# EAGLE design Tasmodul_GPS (EAGLE 9.6.2)
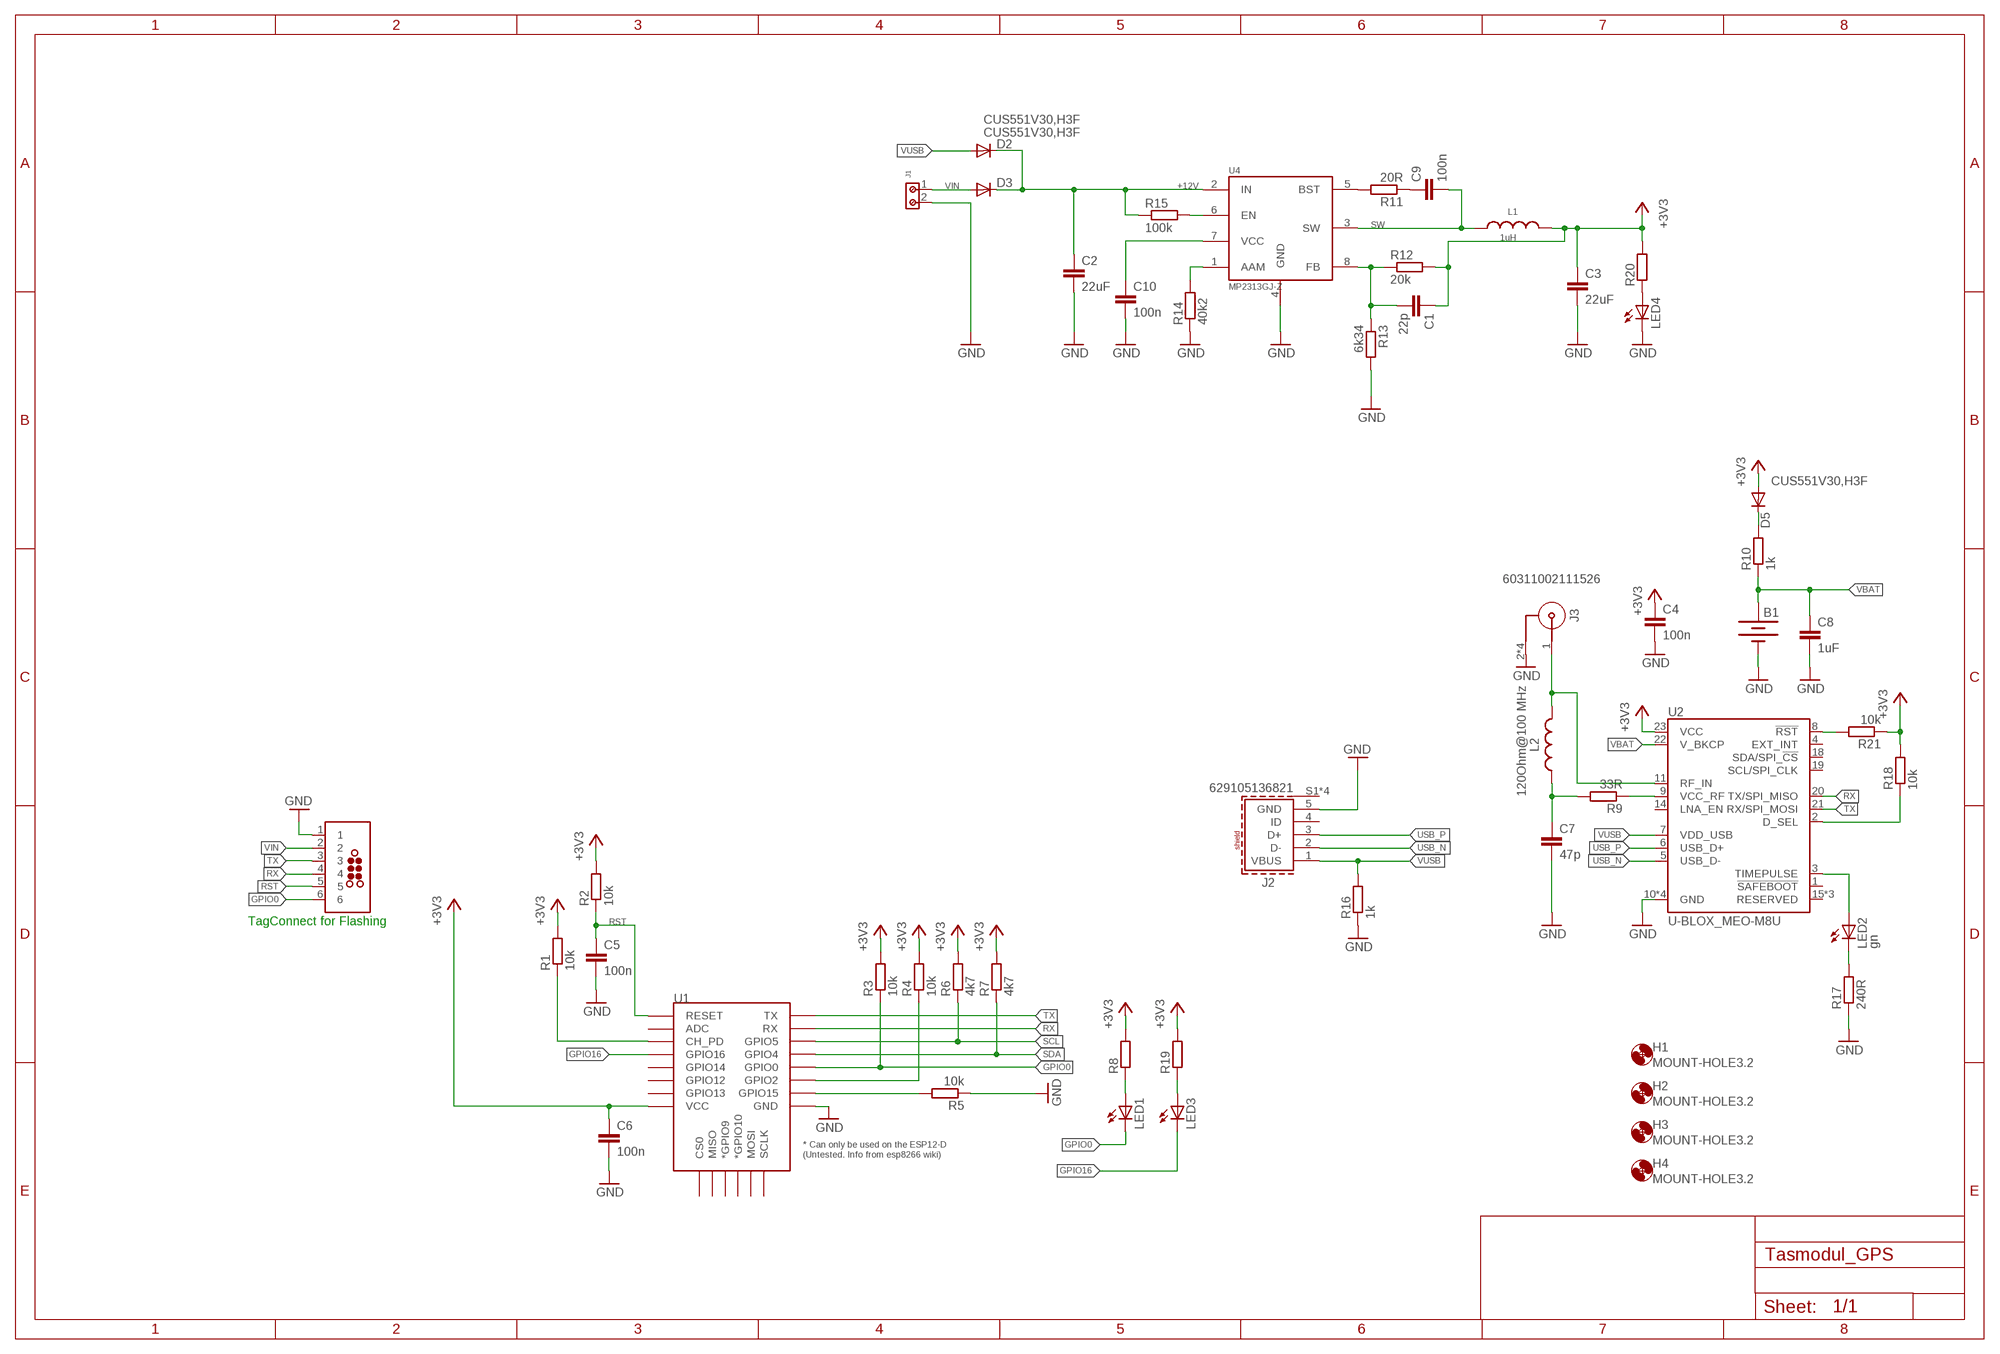
[diagram p0: schematic, sheet 1]

## Parts
B1  6.8MM_COIN_CELL  ML414H_IV01E_BATTERY  [ML414H_IV01E]
C1  22p  C-EUC0603  [C0603]
C2  22uF  C-EUC0805  [C0805]
C3  22uF  C-EUC0805  [C0805]
C4  100n  C-EUC0603  [C0603]
C5  100n  C-EUC0603  [C0603]
C6  100n  C-EUC0603  [C0603]
C7  47p  C-EUC0603  [C0603]
C8  1uF  C-EUC0603  [C0603]
C9  100n  C-EUC0603  [C0603]
C10  100n  C-EUC0603  [C0603]
D2  CUS551V30,H3F  DIODE-SOD323-R  [SOD323-R]
D3  CUS551V30,H3F  DIODE-SOD323-R  [SOD323-R]
D5  CUS551V30,H3F  DIODE-SOD323-R  [SOD323-R]
H1  MOUNT-HOLE3.2  [3,2]
H2  MOUNT-HOLE3.2  [3,2]
H3  MOUNT-HOLE3.2  [3,2]
H4  MOUNT-HOLE3.2  [3,2]
J1  691210910002  [691210910002]
J2  629105136821  [629105136821]
J3  60311002111526  [60311002111526]
J6  TC2030-MCP-NL  [TC2030-MCP-NL]
L1  1uH  WE-TPC_2811_744028001  [WE-TPC_2811_OLD]
L2  120Ohm@100 MHz  WE-CBF_0603_74279262_WB_HS  [WE-CBF_0603(W=2.2)]
LED1  LEDCHIP-LED0603  [CHIP-LED0603]
LED2  gn  LEDCHIP-LED0603  [CHIP-LED0603]
LED3  LEDCHIP-LED0603  [CHIP-LED0603]
LED4  LEDCHIP-LED0603  [CHIP-LED0603]
R1  10k  R-EU_R0603  [R0603]
R2  10k  R-EU_R0603  [R0603]
R3  10k  R-EU_R0603  [R0603]
R4  10k  R-EU_R0603  [R0603]
R5  10k  R-EU_R0603  [R0603]
R6  4k7  R-EU_R0603  [R0603]
R7  4k7  R-EU_R0603  [R0603]
R8  R-EU_R0603  [R0603]
R9  33R  R-EU_R0603  [R0603]
R10  1k  R-EU_R0603  [R0603]
R11  20R  R-EU_R0603  [R0603]
R12  20k  R-EU_R0603  [R0603]
R13  6k34  R-EU_R0603  [R0603]
R14  40k2  R-EU_R0603  [R0603]
R15  100k  R-EU_R0603  [R0603]
R16  1k  R-EU_R0603  [R0603]
R17  240R  R-EU_R0603  [R0603]
R18  10k  R-EU_R0603  [R0603]
R19  R-EU_R0603  [R0603]
R20  R-EU_R0603  [R0603]
R21  10k  R-EU_R0603  [R0603]
U1  ESP12ESMD  [ESP12E-SMD]
U2  U-BLOX_MEO-M8U  [NEO-M9N/M8T/M8U]
U4  MP2313GJ-Z  [TSOT23-8_MPS]

## Nets
+3V3: C1.1 C3.1 C4.1 C6.1 D5.A L1.2 R1.2 R2.2 R3.2 R4.2 R6.2 R7.2 R8.2 R12.2 R18.2 R19.2 R20.2 R21.1 U1.VCC U2.23(VCC)
+12V: C2.1 D2.C D3.C R15.1 U4.2(IN)
GND: B1.- C2.2 C3.2 C4.2 C5.2 C6.2 C7.2 C8.2 C10.2 J1.2 J2.5(GND) J3.2 J3.3 J3.4 J3.5 J6.1 LED4.C R5.1 R13.2 R14.1 R16.1 R17.1 U1.GND U2.10(GND) U2.12(GND) U2.13(GND) U2.24(GND) U4.4(GND)
GPIO0: J6.6 LED1.C R3.1 U1.GPIO0
GPIO16: LED3.C U1.GPIO16
N$1: LED1.A R8.1
N$2: LED2.C R17.2
N$3: J3.1 L2.2 U2.11(RF_IN)
N$4: R21.2 U2.8(!RST)
N$5: R1.1 U1.CH_PD
N$6: R5.2 U1.GPIO15
N$7: R4.1 U1.GPIO2
N$8: D5.C R10.2
N$9: R11.2 U4.5(BST)
N$10: C9.1 R11.1
N$11: R9.1 U2.9(VCC_RF)
N$12: C1.2 R12.1 R13.1 U4.8(FB)
N$13: C10.1 U4.7(VCC)
N$14: R14.2 U4.1(AAM)
N$15: R15.2 U4.6(EN)
N$16: C7.1 L2.1 R9.2
N$17: LED2.A U2.3(TIMEPULSE)
N$18: R18.1 U2.2(D_SEL)
N$19: LED3.A R19.1
N$20: LED4.A R20.1
RST: C5.1 J6.5 R2.1 U1.RESET
RX: J6.4 U1.RXD0(RX) U2.20(TX/SPI_MISO)
SCL: R6.1 U1.GPIO5
SDA: R7.1 U1.GPIO4
SW: C9.2 L1.1 U4.3(SW)
TX: J6.3 U1.TXD0(TX) U2.21(RX/SPI_MOSI)
USB_N: J2.2(D-) U2.5(USB_D-)
USB_P: J2.3(D+) U2.6(USB_D+)
VBAT: B1.+ C8.1 R10.1 U2.22(V_BKCP)
VIN: D3.A J1.1 J6.2
VUSB: D2.A J2.1(VBUS) R16.2 U2.7(VDD_USB)
Unconnected: J2.4(ID) J2.S1(SHIELD) J2.S2(SHIELD) J2.S3(SHIELD) J2.S4(SHIELD) U1.ADC U1.CS0 U1.GPIO9(*GPIO9) U1.GPIO10(*GPIO10) U1.GPIO12 U1.GPIO13 U1.GPIO14 U1.MISO U1.MOSI U1.SCLK U2.1(!SAFEBOOT!) U2.4(EXT_INT) U2.14(LNA_EN) U2.15(RESERVED) U2.16(RESERVED) U2.17(RESERVED) U2.18(SDA/SPI_!CS!) U2.19(SCL/SPI_CLK)

## Notes on the sheet
- TagConnect for Flashing

## Library data of the parts
B1 = SparkFun-Batteries:ML414H_IV01E_BATTERY: SEIKO ML414H-IV01E Reflowable Lithium Battery ML414H is a rechargeable, coin type battery with features such as Pb-free reflowable (Peak temperature: 260 C) and high temperature heat resistance. Battery Characteristics: 3.1V max voltage Voff is 2V 1mAH 3k series resistor with battery 72 hour charge time from 2.0-3.1V 2.3-2.8V initial charge; PROD_ID: BATT-14267
C1-C10 = rcl:C-EU: CAPACITOR, European symbol
D2 D3 D5 = diode:DIODE-: DIODE
H1-H4 = holes:MOUNT-HOLE: MOUNTING HOLE with drill center marker
J1 = Eagle_WR-TBL Rising Cage Clamp (rev20a):691210910002: WR-TBL Serie 2109 - 2.54 mm Horiz. Entry KIND PROPERTIES Pitch 2.54 mm MATERIAL PROPERTIES Insulator Material PA66 Insulator Flammability Rating UL94 V-0 Insulator Color Green Contact Material Brass Contact Plating Copper over Zinc Terminal Screw Material Steel Terminal Screw Plating Zinc Wire Guard Material Brass GENERAL INFORMATION Operating Temperature -40 up to +105 °C Compliance Lead free / RoHS ELECTRICAL PROPERTIES IR cULus 6 A Working Voltage [cULus] 150 V (AC) Withstanding Voltage [cULus] 1300 V (AC) Contact Resistance [cULus] 20 mΩ MECHANICAL PROPERTIES Wire Strip Length 4 up to 5 (mm) Screw M1.6 Solid Wire Section (AWG) 30 to 18 (AWG) Solid Wire Section (Metric) 0.0509 to 0.823 (mm²) Stranded Wire Section (AWG) 30 to 18 (AWG) Stranded Wire Section (Metric) 0.0509 to 0.823 (mm²) CERTIFICATION cULus Approval E315414 PACKAGING PROPERTIES Packaging Box <https://katalog.we-online.com/media/images/v2/o33231v209%20Family_WR-TBL_69121091000x.jpg> Details see: https://katalog.we-online.com/en/em/TBL_2_54_2109_HORIZONTAL_ENTRY_69121091000X Updated by Ella Wu 2019-11-12 2019(C) Wurth Elektronik; DATASHEET-URL: https://www.we-online.com/catalog/datasheet/691210910002.pdf; IR-UL: 6A; MOUNT: THT; PART-NUMBER: 691210910002; PINS: 2; PITCH: 2.54mm; TYPE: Horizontal; WIRE: 30 to 18 (AWG) 0.0509 to 0.823 (mm²); WORKING-VOLTAGE-UL: 150V (AC)
J2 = Eagle_WR-USB (rev21f):629105136821: WR-COM Micro USB 2.0 SMT Type B Horizontal 5 Contacts Kind Properties Durability:10 000 Mating cycles Quality Class:10 000 Mating cycles Connector Type:Micro USB Gender:Receptacle Type:Horizontal General Information Operating Temperature:-40up to +105 °C Compliance:RoHS Electrical Properties IR 1:1A Working Voltage:30V (AC) Withstanding Voltage:100V (AC) Contact Resistance:30 mΩ Material Properties Insulator Material:LCP Insulator Flammability Rating:UL94 V-0 Color:Black Contact Material:Copper Alloy Contact Plating: Gold Contact Type:Stamped Shielding Material:Stainless Steel Shielding Plating:Nickel <https://www.we-online.com/catalog/media/o32999v209%20Family_WR-COM_629105136821.jpg> Details see: https://www.we-online.com/catalog/en/COM_MICRO_SMT_TYPE_B_HORIZONTAL/ Updated by Yingchun, Shan 2020-01-16 2020 (C) Würth Elektronik; APPLICATION: Micro USB 2.0; DATASHEET-URL: https://www.we-online.com/catalog/datasheet/629105136821.pdf; GERDER: Receptacle; INTERFACE-TYPE: Type B; IR1: 1.0A; MOUNT: SMT; PACKAGING: Tape and Reel; PART-NUMBER: 629105136821; PINS: 5; TYPE: Horizontal; WORKING-VOLTAGE: 30V(AC)
J3 = Wurth_Connectors_WR-SMA:60311002111526: WR-SMA SMA PCB THT Jack MATERIAL PROPERTIES Insulator Material PTFE Insulator Color White Center Contact Material Beryllium Copper Center Contact Plating Gold, min. 0.76µm over Nickel Body Material Brass Body Plating Gold, min. 0.076µm over Nickel KIND PROPERTIES Interface MIL-STD-348 Connector Type SMA Gender Jack Orientation Type Right Angle GENERAL INFORMATION Operating Temperature -65 up to +165 °C Compliance RoHS ELECTRICAL PROPERTIES f DC~6 GHz MECHANICAL PROPERTIES Mating Cycle 500 Cycles PACKAGING PROPERTIES Packaging Tray <https://katalog.we-online.com/media/images/v2/o150654v209%20Family_WR-SMA_60311002111526.jpg> Details see: https://katalog.we-online.com/en/em/WR-SMA_60311002111526 Updated by Ella Wu 2019-11-04 2019(C) Würth Elektronik; DATASHEET-URL: https://www.we-online.com/catalog/datasheet/60311002111526.pdf; GENDER: Jack; INTERFACE: MIL-STD-348; MOUNT: THT; ORIENTATION-TYPE: Right Angle; PART-NUMBER: 60311002111526; Z: 50Ohm
J6 = tag-connect:TC2030: TAG-CONNECT ICSP Connector Manufacturer: Tag-Connect <http://www.tag-connect.com> Cable for easy In-Circuit Serial Programming. Designed for Microchip ICD2, suitable for many others. Two variants - one "with legs" (for hands-free fit on PCB) and another "without legs" for quick programming. PAD Description 1 MCLR/Vpp 2 Vdd 3 GND 4 PGD (ISPDAT) 5 PGC (ISPCLK) 6 nc (used for LVP) ©2009 ROFA.cz - modified and updated by Robert Darlington ‹rdarlington@gmail.com›
L1 = Wurth_Power Magnetics_WE-TPC:WE-TPC_2811: WE-TPC SMD Tiny Power Inductor Characteristics Extremely flat power inductor High current capability Magnetically shielded which results in a low leakage field Recommended solder profile: Reflow Operating temperature: –40 °C to +125 °C Applications Portable power like PDA, digital camera, PCMCIA cards and displays DC/DC converter Embedded PC Mobile data gathering, telemetric <https://katalog.we-online.com/media/images/v2/o14870v209%20WE-TPC_Gruppe_2.jpg> Details see: https://katalog.we-online.com/en/pbs/WE-TPC Updated by Yingchun,Shan 2019-07-18 2019(C) Wurth Elektronik; DATASHEET-URL: https://katalog.we-online.com/pbs/datasheet/744028001.pdf; FRES: 150MHz; IR: 1.75A; ISAT: 1.5A; PART-NUMBER: 744028001; RDC-MAX: 85mOhm; RDC-TYP: 65mOhm
L2 = Wurth_EMC Components_WE-CBF:WE-CBF_0603: WE-CBF SMD EMI Suppression Ferrite Bead Characteristics Reliable Ni-Sn electrodes High rated current up to 6 A Operating temperature: –55 ºC to +125 ºC Applications Perfect as data lined filter and for uncoupling of distribution voltage Package name and Variant abbreviation: Package: Wide Band /High Speed: W=Width= 2.2 High Current: W=Width= 2.6 Variant abbreviation: WB = Wide Band HS=High Speed HC=High Current <https://www.we-online.com/catalog/media/o14753v209%20Family_WE-CBF.jpg> Details see: https://www.we-online.com/katalog/en/WE-CBF Updated by Ella Wu 2021-1-12 2021(C) Wurth Elektronik; DATASHEET-URL: https://www.we-online.com/catalog/datasheet/74279262.pdf; IR2: 1350mA; MOUNT: SMT; PART-NUMBER: 74279262; RDC-MAX: 0.3Ohm; TYPE: Wide Band; Z-MAX: 200Ohm@510 MHz
LED1-LED4 = led:LED: LED OSRAM: - CHIPLED LG R971, LG N971, LY N971, LG Q971, LY Q971, LO R971, LY R971 LH N974, LH R974 LS Q976, LO Q976, LY Q976 LO Q996 - Hyper CHIPLED LW Q18S LB Q993, LB Q99A, LB R99A - SideLED LS A670, LO A670, LY A670, LG A670, LP A670 LB A673, LV A673, LT A673, LW A673 LH A674 LY A675 LS A676, LA A676, LO A676, LY A676, LW A676 LS A679, LY A679, LG A679 - Hyper Micro SIDELED® LS Y876, LA Y876, LO Y876, LY Y876 LT Y87S - SmartLED LW L88C, LW L88S LB L89C, LB L89S, LG L890 LS L89K, LO L89K, LY L89K LS L896, LA L896, LO L896, LY L896 - TOPLED LS T670, LO T670, LY T670, LG T670, LP T670 LSG T670, LSP T670, LSY T670, LOP T670, LYG T670 LG T671, LOG T671, LSG T671 LB T673, LV T673, LT T673, LW T673 LH T674 LS T676, LA T676, LO T676, LY T676, LB T676, LH T676, LSB T676, LW T676 LB T67C, LV T67C, LT T67C, LS T67K, LO T67K, LY T67K, LW E67C LS E67B, LA E67B, LO E67B, LY E67B, LB E67C, LV E67C, LT E67C LW T67C LS T679, LY T679, LG T679 LS T770, LO T770, LY T770, LG T770, LP T770 LB T773, LV T773, LT T773, LW T773 LH T774 LS E675, LA E675, LY E675, LS T675 LS T776, LA T776, LO T776, LY T776, LB T776 LHGB T686 LT T68C, LB T68C - Hyper Mini TOPLED® LB M676 - Mini TOPLED Santana® LG M470 LS M47K, LO M47K, LY M47K Source: http://www.osram.convergy.de LUXEON: - LUMILED® LXK2-PW12-R00, LXK2-PW12-S00, LXK2-PW14-U00, LXK2-PW14-V00 LXK2-PM12-R00, LXK2-PM12-S00, LXK2-PM14-U00 LXK2-PE12-Q00, LXK2-PE12-R00, LXK2-PE12-S00, LXK2-PE14-T00, LXK2-PE14-U00 LXK2-PB12-K00, LXK2-PB12-L00, LXK2-PB12-M00, LXK2-PB14-N00, LXK2-PB14-P00, LXK2-PB14-Q00 LXK2-PR12-L00, LXK2-PR12-M00, LXK2-PR14-Q00, LXK2-PR14-R00 LXK2-PD12-Q00, LXK2-PD12-R00, LXK2-PD12-S00 LXK2-PH12-R00, LXK2-PH12-S00 LXK2-PL12-P00, LXK2-PL12-Q00, LXK2-PL12-R00 Source: www.luxeon.com KINGBRIGHT: KA-3528ASYC Source: www.kingbright.com
R1-R21 = rcl:R-EU_: RESISTOR, European symbol
U1 = esp8266modules:ESP12E: ESP12E Module
U2 = SparkFun-GPS:U-BLOX_MEO-M8U: u-blox NEO-M8U The NEO-M8U module introduces u-blox’s Untethered Dead Reckoning (UDR) technology, which provides continuous navigation without requiring speed information from the vehicle. This innovative technology brings the benefits of dead reckoning to installations previously restricted to using GNSS alone, and significantly reduces the cost of installation for after-market dead reckoning applications. The strength of UDR is particularly apparent under poor signal conditions, where it brings continuous positioning in urban environments, even to devices with antennas installed within the vehicle. Useful positioning performance is also available during complete signal loss, for example in parking garages and short tunnels. With UDR, positioning starts as soon as power is applied to the module, before the first GNSS fix is available. The NEO-M8U may be installed in any position within the vehicle without configuration. In addition to its freedom from any electrical connection to the vehicle, the on-board accelerometer and gyroscope sensors result in a fully self-contained solution, perfect for rapid product development with reliable and consistent performance.; PROD_ID: IC-14850
U4 = Eigene-Rietig:MP2313GJ-Z

## Net classes
2 3.3V: width 0.508 mm
3 Antenna: width 1 mm, clearance 0.3 mm

## Board
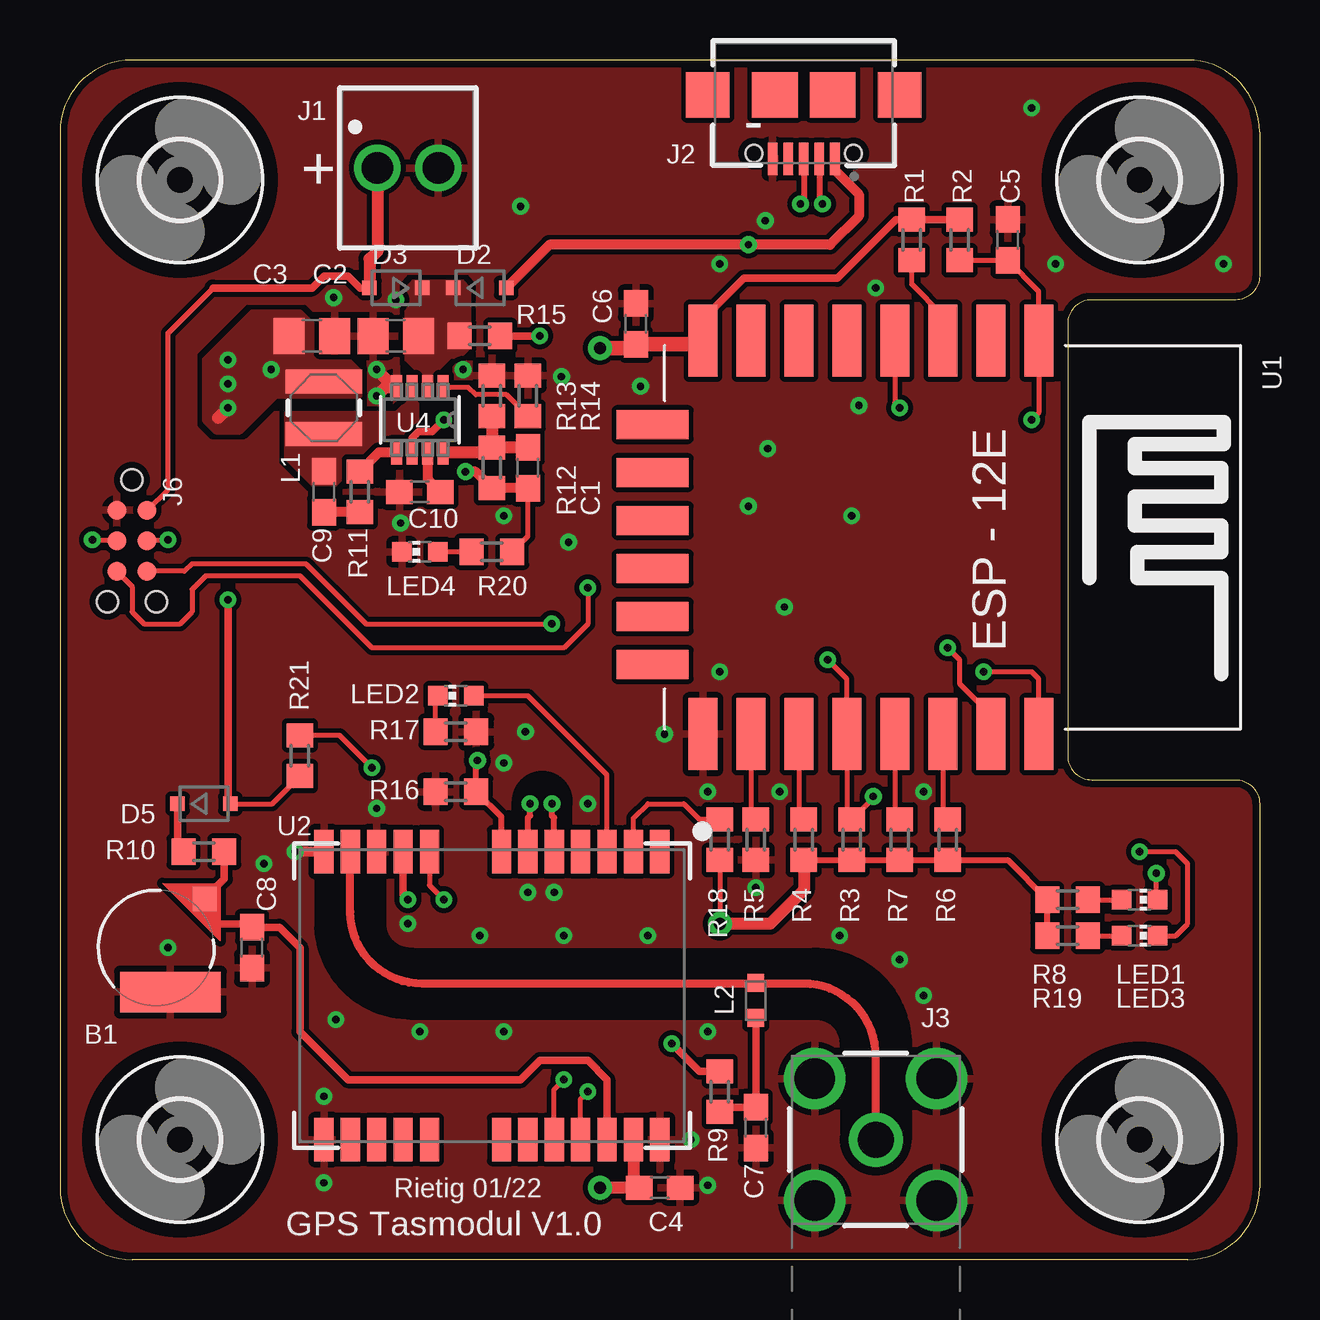
[diagram p1: board, top side]
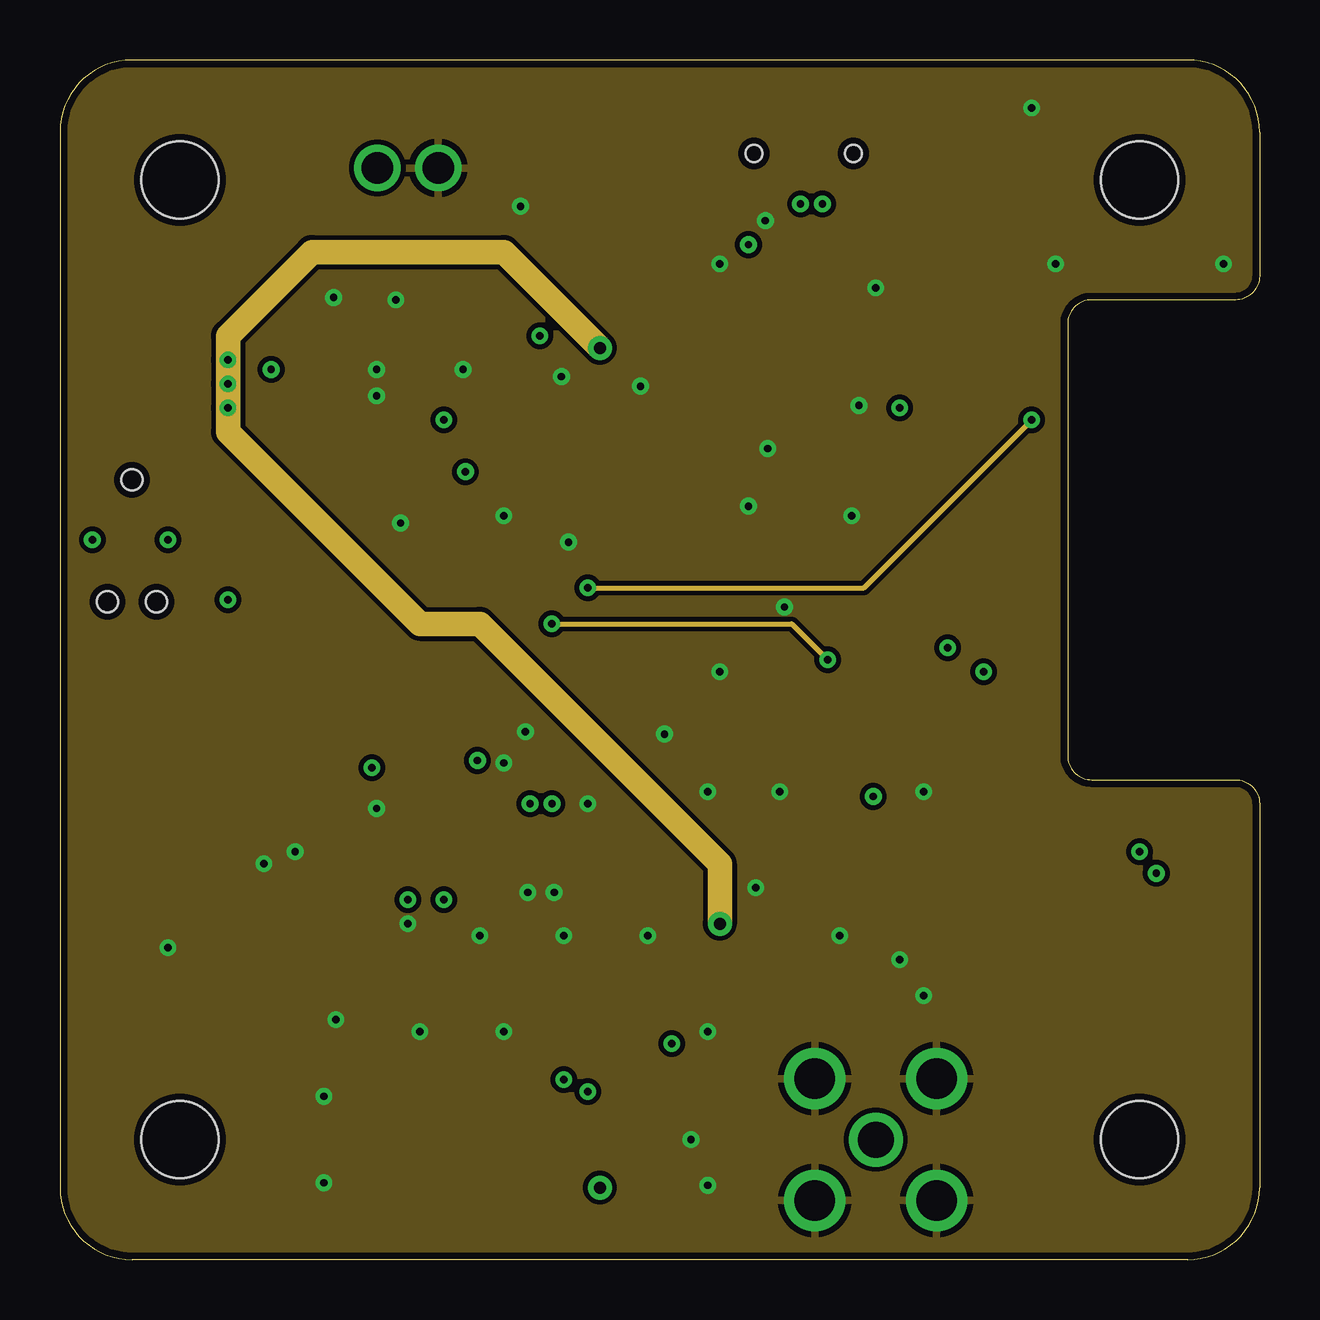
[diagram p2: board, inner layer Route2]
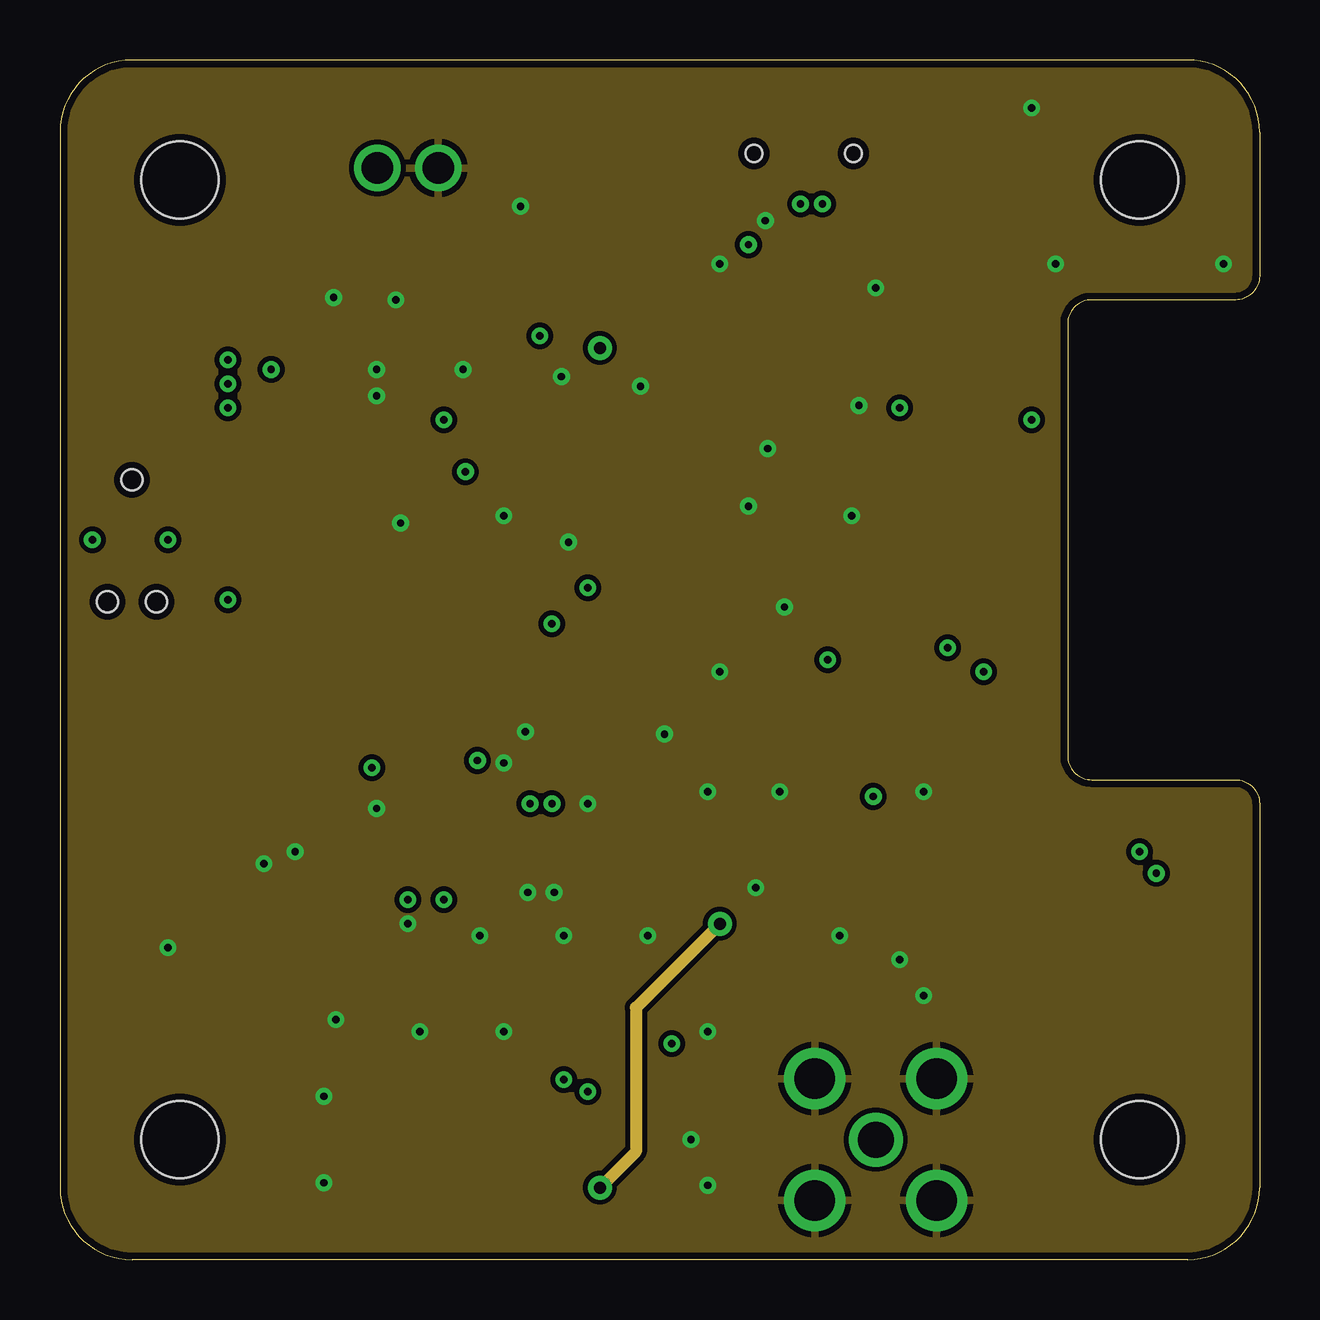
[diagram p3: board, inner layer Route15]
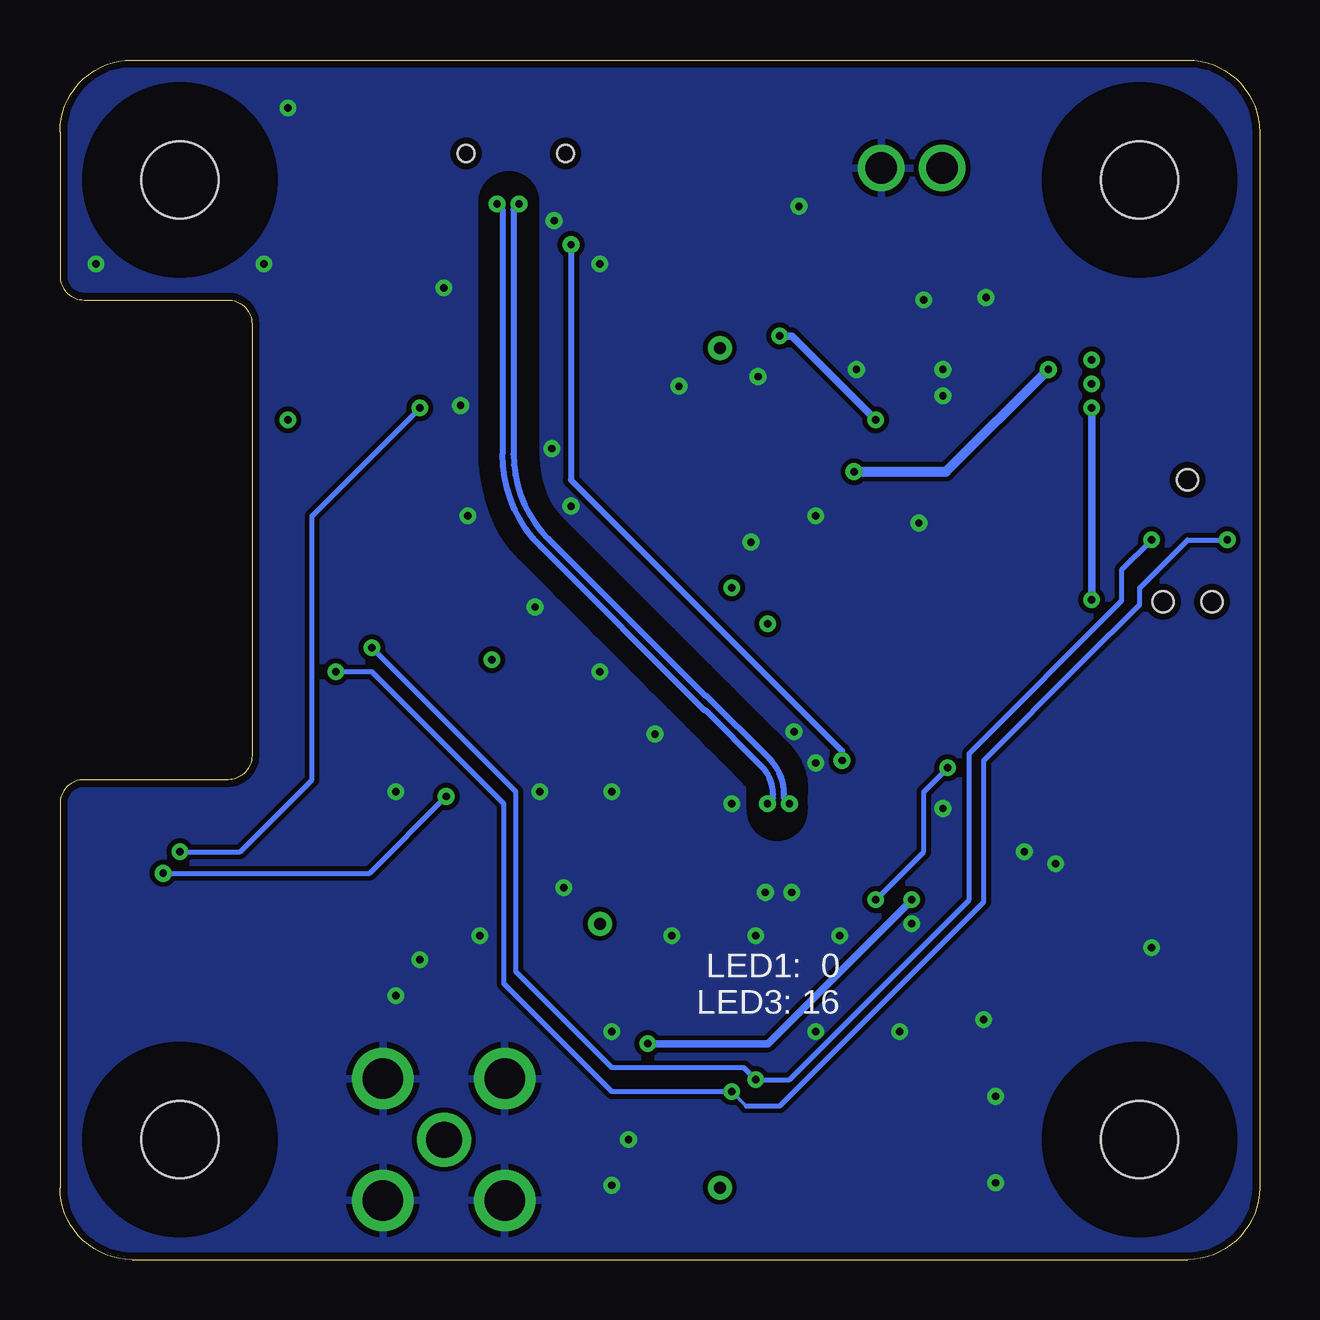
[diagram p4: board, bottom side, seen from below]

Size 50 x 50 mm. Coordinates in mm from the lower left corner, seen from the top.
Outline: 47,0 3,0 arc-90 0,3 0,47 arc-90 3,50 47,50 arc-90 50,47 50,41 arc-90 49,40 43,40 arc90 42,39 42,21 arc90 43,20 49,20 arc-90 50,19 50,3 arc-90 47,0
Copper layers (1+2*15+16): Top 0.035mm / dielectric 0.2mm / Route2 0.0175mm / dielectric 1.065mm / Route15 0.0175mm / dielectric 0.2mm / Bottom 0.035mm
Design rules "default *": minimum track width 5mil, minimum drill 0.3mm, track to track 8mil, track to pad 8mil, pad to pad 8mil, via to via 8mil, smd to smd 8mil, copper to edge 0.3mm, drill to drill 8mil, minimum pad ring 10mil, minimum via ring 8mil, stop-mask expansion 2mil, vias tented up to drill 20mil, thermal gap 10mil
bKeepout: 1 lines
tRestrict: 6 lines
bRestrict: 10 lines

### Footprints (pad centres in the part's own frame; a part is rotated, then mirrored left to right if it is on the bottom)
ML414H_IV01E = smd 1 x 1: + 2.022,2.032 | smd 4.2 x 1.7: - 0.6,-1.85
C0603 = smd 1.1 x 1: 1 -0.85,0; 2 0.85,0
C0805 = smd 1.3 x 1.5: 1 -0.95,0; 2 0.95,0
SOD323-R = smd 0.6 x 0.6: A 1.1,0; C -1.1,0
3,2 = hole 3.2: 0,0
691210910002 = drill 1.3: 1 -1.27,0; 2 1.27,0
629105136821 = smd 0.4 x 1.35: 1 -1.3,2.325; 2 -0.65,2.325; 3 0,2.325; 4 0.65,2.325; 5 1.3,2.325 | smd 1.8 x 1.9: S1 -4,-0.35; S4 4,-0.35 | smd 1.9 x 1.9: S2 -1.2,-0.35; S3 1.2,-0.35 | hole 0.7: -2.075,2.1; 2.075,2.1
60311002111526 = drill 1.5: 1 0,0 | drill 1.7: 2 -2.54,2.54; 3 2.54,2.54; 4 2.54,-2.54; 5 -2.54,-2.54
TC2030-MCP-NL = smd 0.787 x 0.787: 1 1.27,-0.635; 2 1.27,0.635; 3 2.54,-0.635; 4 2.54,0.635; 5 3.81,-0.635; 6 3.81,0.635 | hole 0.889: 0,0; 5.08,-1.016; 5.08,1.016
WE-TPC_2811_OLD = smd 1 x 3.2: 1 -1.1,0; 2 1.1,0
WE-CBF_0603(W=2.2) = smd 0.75 x 0.7: 1 -0.725,0; 2 0.725,0
CHIP-LED0603 = smd 0.8 x 0.8: A 0,-0.75; C 0,0.75
R0603 = smd 1 x 1.1: 1 -0.85,0; 2 0.85,0
ESP12E-SMD = smd 3 x 1.2: ADC -8.3,3.8; CH_PD -8.3,1.8; GND 8.1,-8.2; GPIO0 8.1,-2.2; GPIO2 8.1,-4.2; GPIO4 8.1,-0.2; GPIO5 8.1,1.8; GPIO12 -8.3,-4.2; GPIO13 -8.3,-6.2; GPIO14 -8.3,-2.2; GPIO15 8.1,-6.2; GPIO16 -8.3,-0.2; RESET -8.3,5.8; RXD0 8.1,3.8; TXD0 8.1,5.8; VCC -8.3,-8.2 | smd 1.2 x 3: CS0 -4.8,-10.3; GPIO9 -0.8,-10.3; GPIO10 1.2,-10.3; MISO -2.8,-10.3; MOSI 3.2,-10.3; SCLK 5.2,-10.3
NEO-M9N/M8T/M8U = smd 1.8 x 0.8: 1 6,-7; 2 6,-5.9; 3 6,-4.8; 4 6,-3.7; 5 6,-2.6; 6 6,-1.5; 7 6,-0.4; 8 6,2.6; 9 6,3.7; 10 6,4.8; 11 6,5.9; 12 6,7; 13 -6,7; 14 -6,5.9; 15 -6,4.8; 16 -6,3.7; 17 -6,2.6; 18 -6,-0.4; 19 -6,-1.5; 20 -6,-2.6; 21 -6,-3.7; 22 -6,-4.8; 23 -6,-5.9; 24 -6,-7
TSOT23-8_MPS = smd 1.003 x 0.457: 1 -1.353,0.975; 2 -1.353,0.325; 3 -1.353,-0.325; 4 -1.353,-0.975; 5 1.353,-0.975; 6 1.353,-0.325; 7 1.353,0.325; 8 1.353,0.975

### Placement (x,y rotation side)
B1  4,13 0 top
C1  19.5,33 90 top
C2  14,38.5 180 top
C3  10.5,38.5 0 top
C4  25,3 0 top
C5  39.5,42.5 90 top
C6  24,39 90 top
C7  29,5.5 270 top
C8  8,13 270 top
C9  11,32 90 top
C10  15,32 180 top
D2  17.5,40.5 0 top
D3  14,40.5 180 top
D5  6,19 0 top
H1  5,45 0 top
H2  5,5 0 top
H3  45,5 0 top
H4  45,45 0 top
J1  14.5,45.5 0 top
J2  31,48.2 180 top
J3  34,5 270 top
J6  3,32.5 270 top
L1  11,35.5 90 top
L2  29,10.8 90 top
LED1  45,15 270 top
LED2  16.5,23.5 90 top
LED3  45,13.5 270 top
LED4  15,29.5 90 top
R1  35.5,42.5 90 top
R2  37.5,42.5 90 top
R3  33,17.5 270 top
R4  31,17.5 270 top
R5  29,17.5 90 top
R6  37,17.5 270 top
R7  35,17.5 270 top
R8  42,15 180 top
R9  27.5,7 270 top
R10  6,17 180 top
R11  12.5,32 90 top
R12  18,33 270 top
R13  18,36 90 top
R14  19.5,36 270 top
R15  17.5,38.5 0 top
R16  16.5,19.5 0 top
R17  16.5,22 180 top
R18  27.5,17.5 270 top
R19  42,13.5 180 top
R20  18,29.5 0 top
R21  10,21 90 top
U1  35,30 270 top
U2  18,11 90 top
U4  15,35 270 top

### Tracks (layer width: path | path; a pad name or v marks a point on that pad's centre or on a via)
+3V3  (via drill 0.3 pad 0.6, 0.5 pad 1)
  Top 0.2: R18.2 v27.5,14 | R20.2 19.5,30.15 C1.1 | D5.A 8.85,19 R21.1
  Top 0.254: R4.2 R3.2 R7.2 R6.2 39.5,16.65 R8.2 R19.2
  Top 0.305: R2.2 R1.2 34.85,43.35 32.4,40.9 28.5,40.9 26.9,39.3 26.9,38.4 U1.VCC | D5.A 7,19.1 v7,27.5
  Top 0.406: C1.1 R12.2 17.31,32.84 v16.9,32.84
  Top 0.508: R4.2 31,15.4 29.6,14 v27.5,14 | U2.23 23.9,3.25 C4.1 v22.5,3 | 6.58,35.08 v7,35.5
  Top 0.61: v22.5,38 23.85,38 C6.1 26.65,38.15 26.9,38.4
  Route2 1.016: v22.5,38 18.5,42 10.5,42 7,38.5 v7,37.5 v7,36.5 v7,35.5 7,34.5 15,26.5 17.5,26.5 27.5,16.5 v27.5,14
  Route15 0.508: v22.5,3 24,4.5 24,10.5 v27.5,14
  Bottom 0.305: v7,27.5 v7,35.5
  Bottom 0.406: v16.9,32.84 13.06,32.84 v8.8,37.1
  pour Top (no thermals): 12.5,37 10,39.5 8,39.5 6,37.5 6,35 6.5,34.5 7.5,34.5 9,36 12.5,36
+12V
  pour Top (no thermals): 15.1,36.3 15.5,36.3 15.5,36.8 16.3,37.6 16.7,37.6 17.1,38 17.1,40.5 16.8,40.8 14.7,40.8 14.4,40.5 14.4,37.5 15.1,36.8
GND  (via drill 0.3 pad 0.6)
  Top 0.406: U2.12 v9.8,17
  Top 0.508: v13.2,36 13.55,36.35 U4.4 13.95,36.35 v13.2,37.1
  other vias: 29.5,33.8 28.7,31.4 29.4,43.3 33.3,35.6 33,31 30.2,27.2 13.2,18.8 18.5,20.7 19.4,22 19.5,15.3 20.6,15.3 27,19.5 25.2,21.9 27.5,24.5 16.8,37.1 14.2,30.7 20.9,36.8 11.4,40.1 26.3,5 11,6.8 11,3.2 27,3.1 29,15.5 22,19 14,40 30,19.5 36,19.5 27.5,41.5 8.5,16.5 4.5,13 41.5,41.5 48.5,41.5 34,40.5 40.5,48 18.5,31 14.5,14 11.5,10 35,12.5 24.5,13.5 32.5,13.5 21,13.5 17.5,13.5 18.5,9.5 27,9.5 21.2,29.9 24.2,36.4 19.2,43.9 15,9.5 36,11
  pour Top (rank 6): 0,0 50,0 50,47 arc90 47,50 3,50 arc90 0,47
  pour Bottom: 0,0 0,50 50,50 50,0
  pour Route2: 0,50 50,50 50,0 0,0
  pour Route15: 0,50 50,50 50,0 0,0
GPIO0  (via drill 0.3 pad 0.6)
  Top 0.2: LED1.C 45.7,15.05 v45.7,16.1 | v33.9,19.3 33.9,19.25 R3.1 32.8,18.55 U1.GPIO0 32.8,24.2 v32,25 | v20.5,26.5 12.75,26.5 10.25,29 5.5,29 5.19,28.69 J6.6
  Route2 0.2: v20.5,26.5 30.5,26.5 v32,25
  Bottom 0.2: v45.7,16.1 37.1,16.1 v33.9,19.3
GPIO16  (via drill 0.3 pad 0.6)
  Top 0.2: LED3.C 46.5,13.5 47,14 47,16.5 46.5,17 v45,17 | U1.GPIO16 34.8,35.7 v35,35.5
  Bottom 0.2: v45,17 42.5,17 39.5,20 39.5,31 v35,35.5
N$1
  Top 0.2: R8.1 LED1.A
N$2
  Top 0.2: R17.2 15.65,23.4 LED2.C
N$3
  Top 0.305: L2.2 28.98,11.5
  Top 0.335: J3.1 34,8.5 arc90 31,11.5 28.5,11.5 | U2.11 12.1,14.5 arc90 15.1,11.5 28.5,11.5 | 28.98,11.5 28.5,11.5
N$4  (via drill 0.3 pad 0.6)
  Top 0.2: U2.8 15.4,15.6 v16,15 | v13,20.5 11.65,21.85 R21.2
  Bottom 0.2: v16,15 14,17 14,19.5 v13,20.5
N$5
  Top 0.2: U1.CH_PD 36.8,39.35 35.5,40.65 R1.1
N$6
  Top 0.2: U1.GPIO15 28.8,18.55 R5.2
N$7
  Top 0.2: U1.GPIO2 30.8,18.55 R4.1
N$8
  Top 0.305: D5.C 4.9,17.25 R10.2
N$9
  Top 0.406: R11.2 13.3,33.65 U4.5
N$10
  Top 0.406: R11.1 C9.1
N$11  (via drill 0.3 pad 0.6)
  Top 0.305: R9.1 26.65,7.85 v25.5,9 | v14.5,15 14.3,15.2 U2.9
  Bottom 0.305: v25.5,9 20.5,9 v14.5,15
N$12
  Top 0.508: C1.2 R12.1 | U4.8 17.8,33.65 R12.1 | R13.1 R12.1
N$13
  Top 0.406: U4.7 15.32,32.52 C10.1
N$14
  Top 0.203: R14.2 18.61,36.05 17.32,36.05 17.02,36.35 U4.1
N$15  (via drill 0.3 pad 0.6)
  Top 0.305: v20,38.5 R15.2 | U4.6 14.68,34.23 14.95,34.51 15.51,34.51 v16,35
  Bottom 0.305: v16,35 19.5,38.5 v20,38.5
N$16
  Top 0.305: L2.1 C7.1 27.7,6.35 R9.2
N$17
  Top 0.2: LED2.A 19.5,23.5 22.8,20.2 U2.3
N$18
  Top 0.2: R18.1 26.65,18.35 26,19 24.5,19 23.9,18.4 U2.2
N$19
  Top 0.2: R19.1 LED3.A
N$20
  Top 0.2: R20.1 LED4.A
RST  (via drill 0.3 pad 0.6)
  Top 0.2: R2.1 C5.1 40.8,40.35 U1.RESET 40.8,35.3 v40.5,35 | v22,28 22,26.5 21,25.5 13,25.5 10,28.5 6.07,28.5 5.5,27.93 5.5,27 5,26.5 3.5,26.5 3,27 3,28.05 J6.5
  Route2 0.2: v22,28 33.5,28 v40.5,35
RX  (via drill 0.3, 0.3 pad 0.6)
  Top 0.2: U2.20 20.6,7.1 v21,7.5 | U1.RXD0 38.8,22.7 37.5,24 37.5,25 v37,25.5 | v4.5,30 4.46,29.96 J6.4
  Bottom 0.2: v37,25.5 31,19.5 31,12 27,8 21.5,8 v21,7.5 19.6,7.5 12.1,15 12.1,21.1 5.74,27.46 5.74,28.76 v4.5,30
SCL
  Top 0.2: U1.GPIO5 36.8,18.55 R6.1
SDA
  Top 0.2: U1.GPIO4 34.8,18.55 R7.1
SW
  pour Top (rank 2, no thermals): 14.9,36.3 14.5,36.3 14.5,35.8 14,35.3 9.4,35.3 9.4,33.4 10.5,32.3 11.5,32.3 11.7,32.5 11.7,33.3 12,33.6 12.8,33.6 13.6,34.4 14.3,34.4 14.9,35
TX  (via drill 0.3, 0.3 pad 0.6)
  Top 0.2: U2.21 21.7,6.7 v22,7 | U1.TXD0 40.8,24.2 40.5,24.5 v38.5,24.5 | v1.35,30 2.33,30 J6.3
  Bottom 0.152: v22,7 21.4,6.4 | 7.4,24.9 7.38,24.92
  Bottom 0.2: v22,7 27,7 31.5,11.5 31.5,19 37,24.5 v38.5,24.5 | 21.4,6.4 20,6.4 11.5,14.9 11.5,20.8 7.4,24.9 5,27.3 5,28 3,30 v1.35,30
USB_N  (via drill 0.3 pad 0.6)
  Top 0.254: v31.78,44 31.65,44.13 J2.2 | U2.5 20.6,18.41 20.5,18.5 v20.5,19
  Bottom 0.254: v31.78,44 31.55,43.77 31.55,33.57 arc-45 29.95,29.71 23.15,22.9 23.1,22.9 20.76,20.56 arc45 20.28,19.4 20.28,19.23 v20.5,19
USB_P  (via drill 0.3 pad 0.6)
  Top 0.254: v30.87,44 31,44.13 J2.3 | U2.6 19.5,18.41 19.59,18.5 v19.59,19
  Bottom 0.254: v30.87,44 31.1,43.77 31.1,33.57 arc-45 29.63,30.03 23.1,23.5 23.05,23.5 20.43,20.88 arc45 19.82,19.4 19.82,19.23 v19.59,19
VBAT
  Top 0.305: R10.1 6.85,15.86 B1.+ 6.02,14.48 6.5,14 7.85,14 C8.1 9.15,13.85 10,13 10,9.5 12,7.5 19.2,7.5 20,8.3 22,8.3 22.8,7.5 U2.22
VIN
  Top 0.2: J6.2 4.5,32.09 4.5,38.62 6.38,40.5
  Top 0.305: 6.38,40.5 10.5,40.5 11,41 12,41 12.5,40.5 D3.A
  Top 0.508: J1.1 13.23,42.03 12.9,41.7 D3.A
VUSB  (via drill 0.3 pad 0.6)
  Top 0.254: U2.7 18.4,18.45 R16.2 17.35,20.75 v17.4,20.8
  Top 0.406: J2.1 32.3,45.4 33.3,44.4 33.3,43.5 32.1,42.3 v28.7,42.3 20.4,42.3 D2.A
  Bottom 0.254: v17.4,20.8 17.4,21.2 28.7,32.5 v28.7,42.3

### Text on the board
tPlace: - | + | Rietig 01/22 | GPS Tasmodul V1.0
bPlace: LED1: 0 / LED3: 16